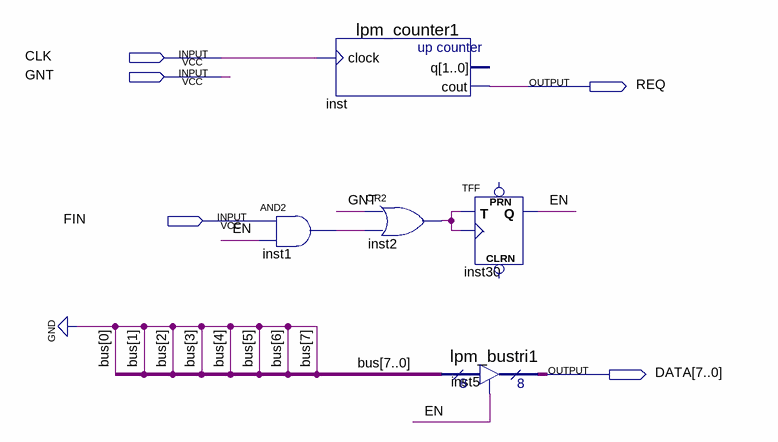
[diagram p0: schematic sheet]
// Quartus schematic master0.bdf as structural Verilog: 5 symbols, 5 pins
module master0 (
  input  CLK,
  input  GNT,
  input  FIN,
  output REQ,
  output [7:0] DATA
);

  wire EN, inst1_out, inst2_out;

  and inst1 (inst1_out, FIN, EN);
  lpm_counter1 inst (.clock(CLK), .cout(REQ));  // open: q
  or inst2 (inst2_out, GNT, inst1_out);
  TFF inst30 (.T(inst2_out), .CLK(inst2_out), .Q(EN));  // open: PRN, CLRN
  lpm_bustri1 inst5 (.enabledt(EN), .data({8{1'b0}}), .tridata(DATA));
endmodule
